# Altium schematic sheet Balancing_Robot_1_2_Sensors.SchDoc: Hebrides Robot - Sensors
size A3; DrawnBy: Stuart Taylor; Revision: 1.2; SheetNumber: 2; SheetTotal: 3
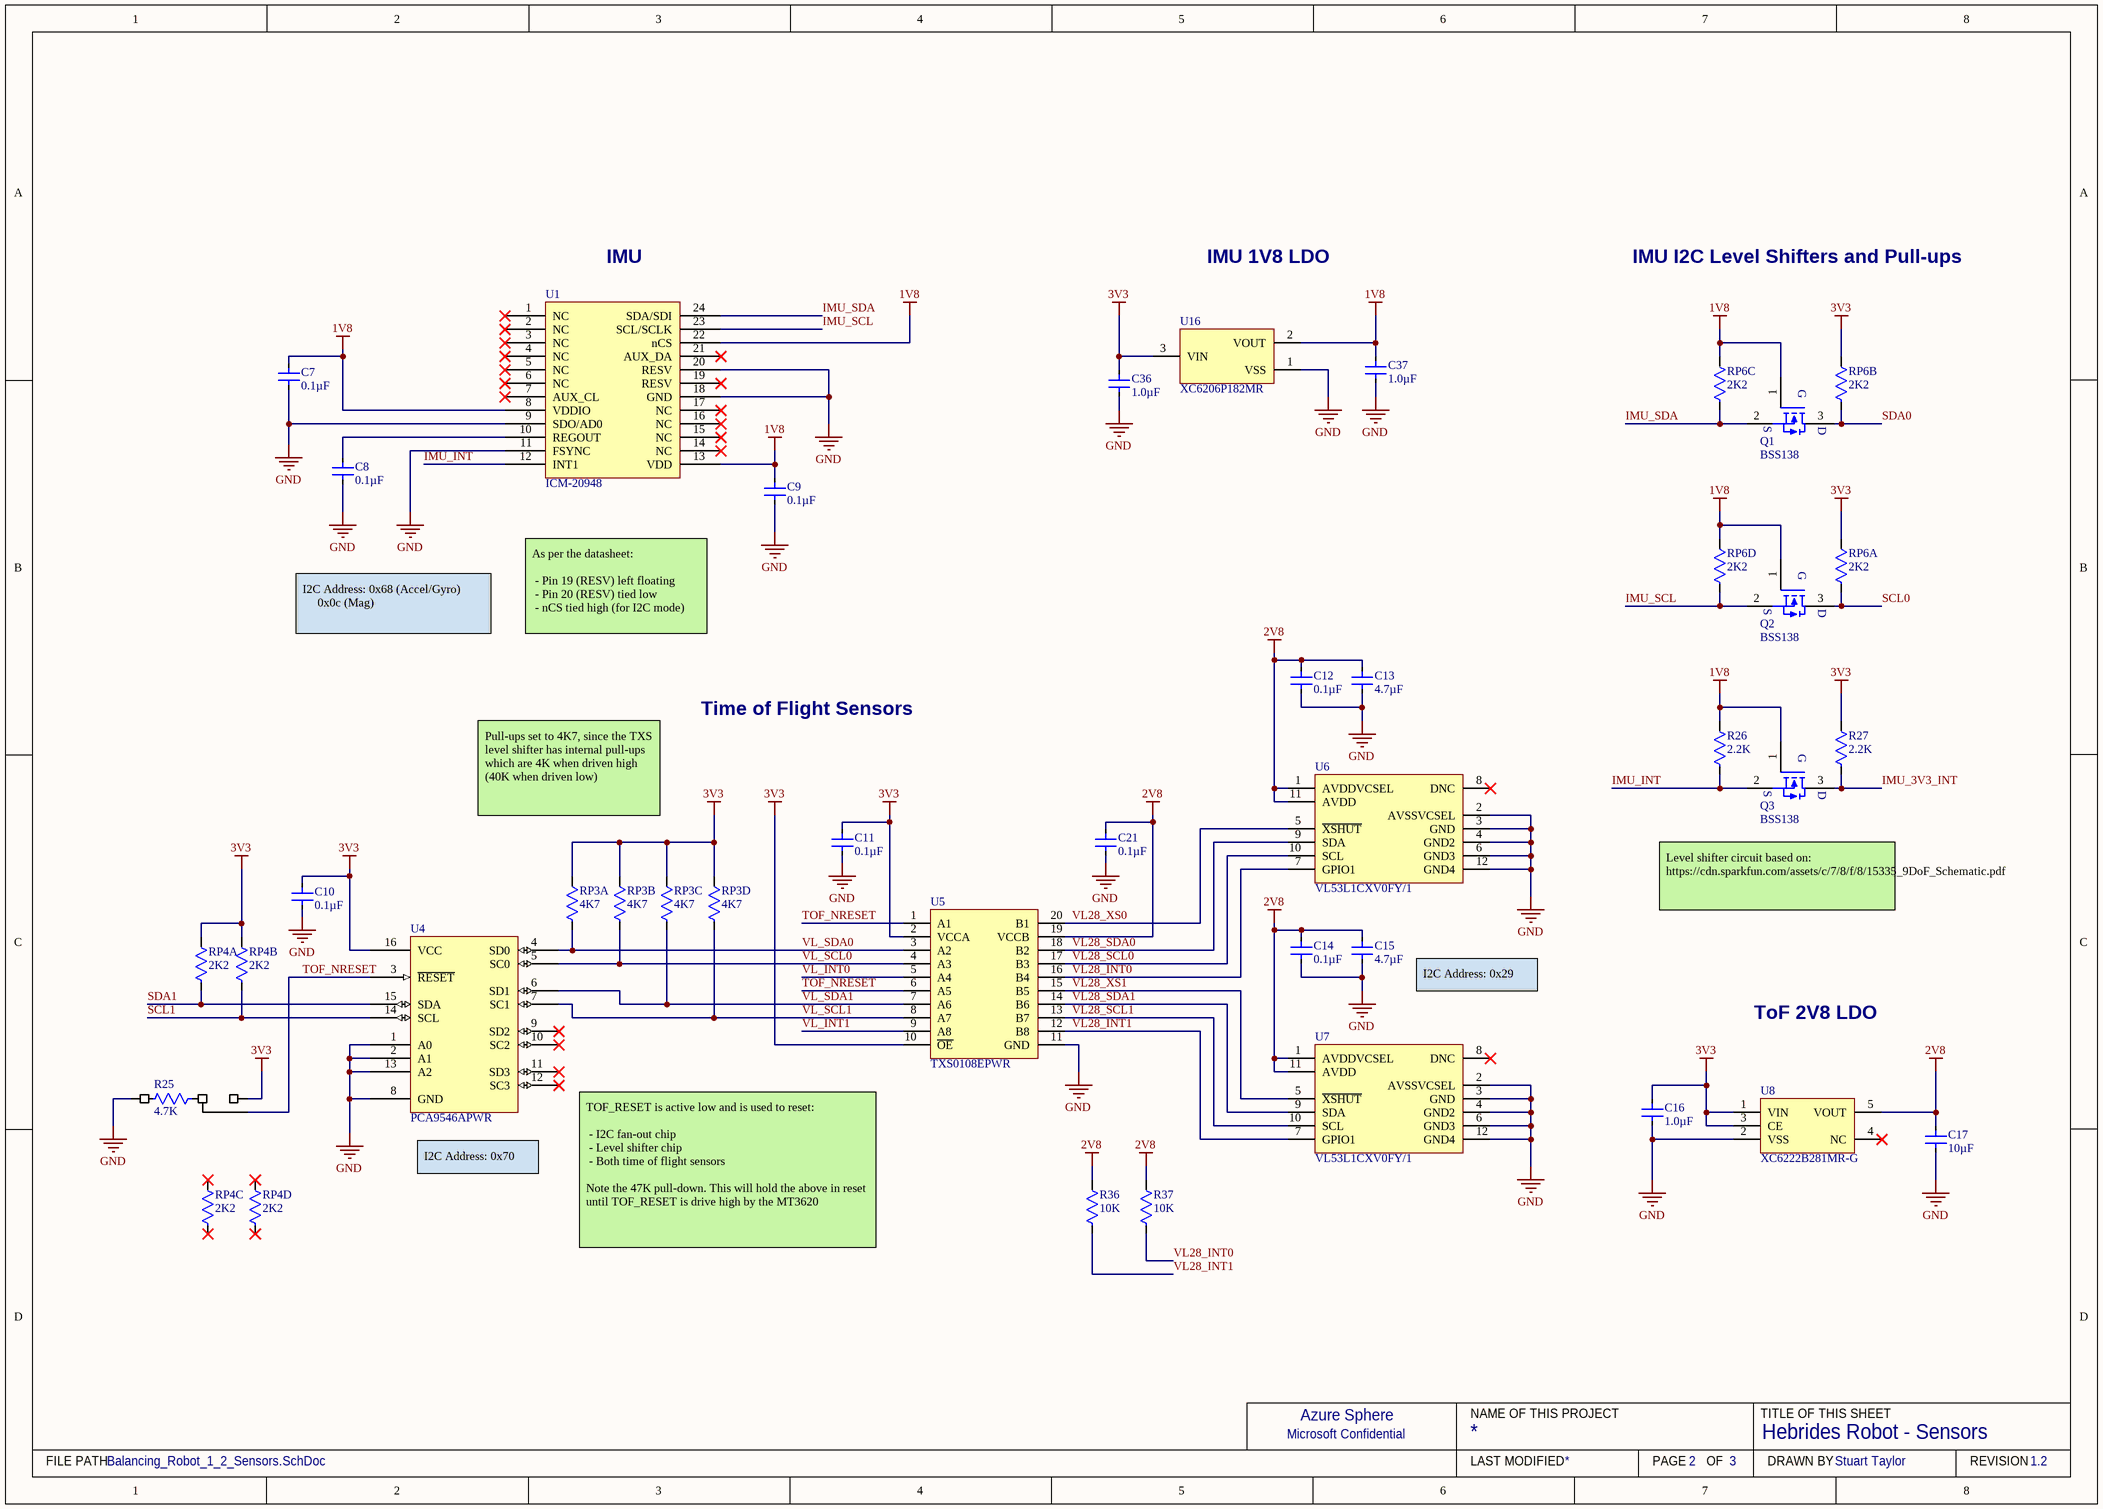
[diagram p0: Balancing_Robot_1_2_Sensors.SchDoc]

## Parts
C7  0.1µF  [CAPC1005-EIA0402 0.55MM MED]
C8  0.1µF  [CAPC1005-EIA0402 0.55MM MED]
C9  0.1µF  [CAPC1005-EIA0402 0.55MM MED]
C10  0.1µF  [CAPC1005-EIA0402 0.55MM MED]
C11  0.1µF  [CAPC1005-EIA0402 0.55MM MED]
C12  0.1µF  [CAPC1005-EIA0402 0.55MM MED]
C13  Capacitance: 4.7µF  [CAPC1005-EIA0402 0.55MM MED]  (hidden comment: C1005X5R1A475K050BC)
C14  0.1µF  [CAPC1005-EIA0402 0.55MM MED]
C15  Capacitance: 4.7µF  [CAPC1005-EIA0402 0.55MM MED]  (hidden comment: C1005X5R1A475K050BC)
C16  Capacitance: 1.0µF  [CAPC1005-EIA0402 0.55MM MED]  (hidden comment: C1005X5R1V105K050BC)
C17  10µF  [CAPC1005-EIA0402 0.55MM MED]
C21  0.1µF  [CAPC1005-EIA0402 0.55MM MED]
C36  Capacitance: 1.0µF  [CAPC1005-EIA0402 0.55MM MED]  (hidden comment: C1005X5R1V105K050BC)
C37  Capacitance: 1.0µF  [CAPC1005-EIA0402 0.55MM MED]  (hidden comment: C1005X5R1V105K050BC)
Q1  BSS138  [TOREX-SOT23-3]
Q2  BSS138  [TOREX-SOT23-3]
Q3  BSS138  [TOREX-SOT23-3]
R25  4.7K  [THREE-WAY-0402-NO-SHORT]
R26  2.2K  [RES 0402 MEDIUM DENSITY]
R27  2.2K  [RES 0402 MEDIUM DENSITY]
R36  10K  [RES 0402 MEDIUM DENSITY]
R37  10K  [RES 0402 MEDIUM DENSITY]
RP3  4K7  [EXB-N8V]  (parts A,B,C,D of 4)
RP4  2K2  [EXB-N8V]  (parts A,B,C,D of 4)
RP6  2K2  [EXB-N8V]  (parts A,B,C,D of 4)
U1  ICM-20948  [ICM_20948]
U4  PCA9546APWR  [PCA9546APWR]
U5  TXS0108EPWR  [TXS0108EPWR]
U6  VL53L1CXV0FY/1  [VL53L1X]
U7  VL53L1CXV0FY/1  [VL53L1X]
U8  XC6222B281MR-G  [SOT25]
U16  XC6206P182MR  [TOREX-SOT23-3]

## Nets
1V8: C7.2 C9.2 C37.2 Q1.1(G) Q2.1(G) Q3.1(G) R26.1 RP6.6 RP6.8 U1.8(VDDIO) U1.13(VDD) U1.22(nCS) U16.2(VOUT)
2V8: C12.2 C13.2 C14.2 C15.2 C17.2 C21.2 R36.1 R37.1 U5.19(VCCB) U6.1(AVDDVCSEL) U6.11(AVDD) U7.1(AVDDVCSEL) U7.11(AVDD) U8.5(VOUT)
3V3: C10.2 C11.2 C16.2 C36.2 R25.3 R27.1 RP3.2 RP3.4 RP3.6 RP3.8 RP4.2 RP4.4 RP6.2 RP6.4 U4.16(VCC) U5.2(VCCA) U5.10(~{OE}) U8.1(VIN) U8.3(CE) U16.3(VIN)
GND: C7.1 C8.1 C9.1 C10.1 C11.1 C12.1 C13.1 C14.1 C15.1 C16.1 C17.1 C21.1 C36.1 C37.1 R25.1 U1.9(SDO/AD0) U1.11(FSYNC) U1.18(GND) U1.20(RESV) U4.1(A0) U4.2(A1) U4.8(GND) U4.13(A2) U5.11(GND) U6.2(AVSSVCSEL) U6.3(GND) U6.4(GND2) U6.6(GND3) U6.12(GND4) U7.2(AVSSVCSEL) U7.3(GND) U7.4(GND2) U7.6(GND3) U7.12(GND4) U8.2(VSS) U16.1(VSS)
IMU_3V3_INT: Q3.3(D) R27.2
IMU_INT: Q3.2(S) R26.2 U1.12(INT1)
IMU_SCL: Q2.2(S) RP6.7 U1.23(SCL/SCLK)
IMU_SDA: Q1.2(S) RP6.5 U1.24(SDA/SDI)
SCL0: Q2.3(D) RP6.1
SCL1: RP4.3 U4.14(SCL)
SDA0: Q1.3(D) RP6.3
SDA1: RP4.1 U4.15(SDA)
TOF_NRESET: R25.2 U4.3(~{RESET}) U5.1(A1) U5.6(A5)
VL28_INT0: R37.2 U5.16(B4) U6.7(GPIO1)
VL28_INT1: R36.2 U5.12(B8) U7.7(GPIO1)
VL28_SCL0: U5.17(B3) U6.10(SCL)
VL28_SCL1: U5.13(B7) U7.10(SCL)
VL28_SDA0: U5.18(B2) U6.9(SDA)
VL28_SDA1: U5.14(B6) U7.9(SDA)
VL28_XS0: U5.20(B1) U6.5(~{XSHUT})
VL28_XS1: U5.15(B5) U7.5(~{XSHUT})
VL_INT0: U5.5(A4)
VL_INT1: U5.9(A8)
VL_SCL0: RP3.3 U4.5(SC0) U5.4(A3)
VL_SCL1: RP3.7 U4.7(SC1) U5.8(A7)
VL_SDA0: RP3.1 U4.4(SD0) U5.3(A2)
VL_SDA1: RP3.5 U4.6(SD1) U5.7(A6)
NetC8_2: C8.2 U1.10(REGOUT)

Not connected (* = marked no-connect by the designer): RP4 5* 6* 7* 8*; U1 1(NC)* 2(NC)* 3(NC)* 4(NC)* 5(NC)* 6(NC)* 7(AUX_CL)* 14(NC)* 15(NC)* 16(NC)* 17(NC)* 19(RESV)* 21(AUX_DA)*; U4 9(SD2)* 10(SC2)* 11(SD3)* 12(SC3)*; U6 8(DNC)*; U7 8(DNC)*; U8 4(NC)*

## Notes on the sheet
- (near U1) IMU
- IMU 1V8 LDO
- IMU I2C Level Shifters and Pull-ups
- I2C Address: 0x68 (Accel/Gyro)
  0x0c (Mag)
- As per the datasheet:
  - Pin 19 (RESV) left floating
  - Pin 20 (RESV) tied low
  - nCS tied high (for I2C mode)
- Time of Flight Sensors
- Pull-ups set to 4K7, since the TXS level shifter has internal pull-ups which are 4K when driven high (40K when driven low)
- Level shifter circuit based on: https://cdn.sparkfun.com/assets/c/7/8/f/8/15335_9DoF_Schematic.pdf
- I2C Address: 0x29
- ToF 2V8 LDO
- (near U4) I2C Address: 0x70
- TOF_RESET is active low and is used to reset:
  - I2C fan-out chip
  - Level shifter chip
  - Both time of flight sensors
  Note the 47K pull-down. This will hold the above in reset until TOF_RESET is drive high by the MT3620
- Microsoft Confidential
- Azure Sphere
- NAME OF THIS PROJECT
- TITLE OF THIS SHEET
- FILE PATH
- LAST MODIFIED
- PAGE
- OF
- DRAWN BY
- REVISION

## Library data of the parts
C7-C12 C14 C21 = 0.1µF 0402 X7R 50V: CAP CER 0.1UF 50V 10% X7R 0402; Manufacturer: TDK Corporation; Manufacturer Part Number: C1005X7R1H104K050BB; Supplier 1: Digi-Key; RoHS: RoHS Compliant; Category: Capacitors; Stock 1: 47833; Pricing 1: 0.01305; Packaging: Tape & Reel (TR); Tolerance: ±10%; Voltage - Rated: 50V; Temperature Coefficient: X7R; Mounting Type: Surface Mount, MLCC; Operating Temperature: -55°C ~ 125°C; Applications: General Purpose; Package / Case: 0402 (1005 Metric); Size / Dimension: 0.039" L x 0.020" W (1.00mm x 0.50mm); Height - Seated (Max): -; Thickness (Max): 0.022" (0.55mm); Lead Spacing: -; Features: -; Lead Style: -; ComponentLink1URL: http://product.tdk.com/en/catalog/datasheets/mlcc_commercial_general_en.pdf; ComponentLink1Description: http://product.tdk.com/en/catalog/datasheets/mlcc_commercial_general_en.pdf; Supplier Part Number 1: 445-5932-2-ND; Ratings: -; Capacitance: 0.1µF
C13 C15 = 4.7µF 0402 X5R 10V: CAP CER 4.7UF 10V 10% X5R 0402; Manufacturer: TDK Corporation; Supplier 1: Digi-Key; Manufacturer Part Number: C1005X5R1A475K050BC; RoHS: RoHS Compliant; Category: Capacitors; Stock 1: 47833; Pricing 1: 0.06265; Packaging: Tape & Reel (TR); Tolerance: ±10%; Voltage - Rated: 10V; Temperature Coefficient: X5R; Mounting Type: Surface Mount, MLCC; Operating Temperature: -55°C ~ 125°C; Applications: General Purpose; Package / Case: 0402 (1005 Metric); Size / Dimension: 0.039" L x 0.020" W (1.00mm x 0.50mm); Height - Seated (Max): -; Thickness (Max): 0.022" (0.55mm); Lead Spacing: -; Features: -; Lead Style: -; ComponentLink1URL: http://product.tdk.com/en/catalog/datasheets/mlcc_commercial_general_en.pdf; ComponentLink1Description: http://product.tdk.com/en/catalog/datasheets/mlcc_commercial_general_en.pdf; Supplier Part Number 1: 445-13820-2-ND; Ratings: -
C16 C36 C37 = 1.0µF 0402 X5R 35V: CAP CER 1UF 35V 10% X5R 0402; Manufacturer: TDK Corporation; Supplier 1: Digi-Key; Manufacturer Part Number: C1005X5R1V105K050BC; RoHS: RoHS Compliant; Category: Capacitors; Stock 1: 47833; Pricing 1: 0.0186; Packaging: Tape & Reel (TR); Tolerance: ±10%; Voltage - Rated: 35V; Temperature Coefficient: X5R; Mounting Type: Surface Mount, MLCC; Operating Temperature: -55°C ~ 125°C; Applications: General Purpose; Package / Case: 0402 (1005 Metric); Size / Dimension: 0.039" L x 0.020" W (1.00mm x 0.50mm); Height - Seated (Max): -; Thickness (Max): 0.022" (0.55mm); Lead Spacing: -; Features: -; Lead Style: -; ComponentLink1URL: http://product.tdk.com/en/catalog/datasheets/mlcc_commercial_general_en.pdf; ComponentLink1Description: http://product.tdk.com/en/catalog/datasheets/mlcc_commercial_general_en.pdf; Supplier Part Number 1: 445-9073-2-ND; Ratings: -
C17 = 10µF 0402 X5R 6.3V: CAP CER 10UF 6.3V 20% X5R 0402; Manufacturer: TDK Corporation; Manufacturer Part Number: C1005X5R0J106M050BC; Supplier 1: Digi-Key; RoHS: RoHS Compliant; Category: Capacitors; Stock 1: 47833; Pricing 1: 0.07766; Packaging: Tape & Reel (TR); Tolerance: ±20%; Voltage - Rated: 6.3V; Temperature Coefficient: X5R; Mounting Type: Surface Mount, MLCC; Operating Temperature: -55°C ~ 125°C; Applications: General Purpose; Package / Case: 0402 (1005 Metric); Size / Dimension: 0.039" L x 0.020" W (1.00mm x 0.50mm); Height - Seated (Max): -; Thickness (Max): 0.020" (0.50mm); Lead Spacing: -; Features: -; Lead Style: -; ComponentLink1URL: http://product.tdk.com/en/catalog/datasheets/mlcc_commercial_general_en.pdf; ComponentLink1Description: http://product.tdk.com/en/catalog/datasheets/mlcc_commercial_general_en.pdf; Supplier Part Number 1: 445-8920-2-ND; Ratings: -; Capacitance: 10µF
Q1-Q3 = BSS138: MOSFET N-CH 50V 220MA SOT-23; Manufacturer: Micross; Supplier 1: Digi-Key; Manufacturer Part Number: BSS138; Stock 1: 0; Pricing 1: 25 = 4.00000 (USD); Supplier Part Number 1: BSS138-DIE-ND
R25 = THREE-WAY-4K7-0402-NO-SHORT: RES SMD 4.7K JUMPER 1/10W 0402; Manufacturer: Panasonic Electronic Components; Manufacturer Part Number: ERJ-2RKF4701X; Power (Watts): 0.1W, 1/10W; Supplier 1: Digi-Key; RoHS: RoHS Compliant; Category: Resistors; Stock 1: 3259868; Pricing 1: 1=0.08, 50=0.0104, 100=0.0079, 250=0.00588, 500=0.00436, 1000=0.0029, 5000=0.00204 (GBP); Packaging: Cut Tape (CT); Part Status: Active; Resistance (Ohms): 4.7K; Tolerance: Jumper; Composition: Thick Film; Features: -; Temperature Coefficient: -; Operating Temperature: -55°C ~ 155°C; Package / Case: 0402 (1005 Metric); Supplier Device Package: 0402; Size / Dimension: 0.039" L x 0.020" W (1.00mm x 0.50mm); Height: 0.016" (0.40mm); Number of Terminations: 2; ComponentLink1URL: http://industrial.panasonic.com/www-cgi/jvcr13pz.cgi?E+PZ+3+AOA0001+ERJ2GE0R00X+7+WW; ComponentLink1Description: http://industrial.panasonic.com/www-cgi/jvcr13pz.cgi?E+PZ+3+AOA0001+ERJ2GE0R00X+7+WW; Supplier Part Number: P4.7KLCT-ND
R26 R27 = 2.2K: RES 2.2K OHM 1/10W 1% 0402 SMD; Manufacturer: Panasonic Electronic Components; Manufacturer Part Number: ERJ-2RKF2201X; Power (Watts): 0.1W, 1/10W; Temperature Coefficient: ±100ppm/°C; Supplier 1: Digi-Key; Supplier Part Number 1: P2.20KLCT-ND; RoHS: RoHS Compliant; Category: Resistors; Stock 1: 529147; Pricing 1: 1=0.07, 50=0.0128, 100=0.0097, 250=0.0072, 500=0.00532, 1000=0.00355, 5000=0.0025 (GBP); Packaging: Cut Tape (CT); Tolerance: ±1%; Composition: Thick Film; Features: -; Package / Case: 0402 (1005 Metric); Supplier Device Package: 0402; Size / Dimension: 0.039" L x 0.020" W (1.00mm x 0.50mm); Height: 0.016" (0.40mm); Number of Terminations: 2; ComponentLink1URL: http://industrial.panasonic.com/www-cgi/jvcr13pz.cgi?E+PZ+3+AOA0002+ERJ2RKF2201X+7+WW; ComponentLink1Description: http://industrial.panasonic.com/www-cgi/jvcr13pz.cgi?E+PZ+3+AOA0002+ERJ2RKF2201X+7+WW; Resistance (Ohms): 2.2K
R36 R37 = 10K: RES 10K OHM 1/10W 1% 0402 SMD; Manufacturer: Panasonic Electronic Components; Manufacturer Part Number: ERJ-2RKF1002X; Power (Watts): 0.1W, 1/10W; Temperature Coefficient: ±100ppm/°C; Supplier 1: Digi-Key; Supplier Part Number 1: P10.0KLCT-ND; RoHS: RoHS Compliant; Category: Resistors; Stock 1: 4805447; Pricing 1: 1=0.07, 50=0.0128, 100=0.0097, 250=0.0072, 500=0.00532, 1000=0.00355, 5000=0.0025 (GBP); Packaging: Cut Tape (CT); Tolerance: ±1%; Composition: Thick Film; Features: -; Package / Case: 0402 (1005 Metric); Supplier Device Package: 0402; Size / Dimension: 0.039" L x 0.020" W (1.00mm x 0.50mm); Height: 0.016" (0.40mm); Number of Terminations: 2; ComponentLink1URL: http://industrial.panasonic.com/www-cgi/jvcr13pz.cgi?E+PZ+3+AOA0002+ERJ2RKF1002X+7+WW; ComponentLink1Description: http://industrial.panasonic.com/www-cgi/jvcr13pz.cgi?E+PZ+3+AOA0002+ERJ2RKF1002X+7+WW; Resistance (Ohms): 10K
RP3 = EXB-N8V472JX: Res Thick Film Array 4.7K Ohm 5% ±200ppm/C ISOL Molded 8-Pin 0804(4 X 0402) Concave SMD Punched Carrier T/R; Manufacturer: Panasonic / Panasonic ECG; Power Rating per Element: 31mW; Voltage Rating: 50V; Temperature Coefficient: ± 200ppm/°C; No. of Elements: 4; Resistor Case Style: 0402 [1005 Metric]; SVHC: Diboron trioxide (19-Dec-2012); Resistor Terminals: (Not Available); SVHC (Secondary): Lead monoxide (lead oxide) (19-Dec-2012); No. of Pins: 8; Network Circuit Type: Isolated; Supplier 1: Digikey; Manufacturer Part Number: EXB-N8V472JX; Stock 1: 38086; Pricing 1: 1=0.1, 10=0.075, 25=0.0544, 50=0.0414, 100=0.0305, 250=0.0233, 500=0.0186, 1000=0.0137, 5000=0.0098 (USD); Resistance: 4.7kohm; Resistance Tolerance: ± 5%; Resistor Mounting: SMD; Packaging: Cut Tape; ComponentLink1URL: https://datasheet.ciiva.com/5735/1480003-5735259.pdf; ComponentLink1Description: https://datasheet.ciiva.com/5735/1480003-5735259.pdf; ComponentLink2URL: https://datasheet.ciiva.com/46376/1480003-46376271.pdf; ComponentLink2Description: https://datasheet.ciiva.com/46376/1480003-46376271.pdf; ComponentLink3URL: https://datasheet.ciiva.com/30229/aoc0000ce1-30229813.pdf; ComponentLink3Description: https://datasheet.ciiva.com/30229/aoc0000ce1-30229813.pdf; ComponentLink4URL: https://datasheet.ciiva.com/46387/1480003-46387943.pdf; ComponentLink4Description: https://datasheet.ciiva.com/46387/1480003-46387943.pdf; Supplier Part Number 1: Y10472CT-ND
RP4 RP6 = EXB-N8V222JX: Res Thick Film Array 2K2 Ohm 5% ±200ppm/C ISOL Molded 8-Pin 0804(4 X 0402) Concave SMD Punched Carrier T/R; Manufacturer: Panasonic / Panasonic ECG; Resistance: 2.2kohm; Power Rating per Element: 31mW; Voltage Rating: 50V; Temperature Coefficient: ± 200ppm/°C; No. of Elements: 4; Resistor Case Style: 0402 [1005 Metric]; SVHC: Diboron trioxide (19-Dec-2012); Resistor Terminals: (Not Available); SVHC (Secondary): Lead monoxide (lead oxide) (19-Dec-2012); No. of Pins: 8; Network Circuit Type: Isolated; Supplier 1: Digikey; Manufacturer Part Number: EXB-N8V222JX; Stock 1: 17267; Pricing 1: 1=0.1, 10=0.075, 25=0.0544, 50=0.0414, 100=0.0305, 250=0.0233, 500=0.0186, 1000=0.0137, 5000=0.0098 (USD); Resistance Tolerance: ± 5%; Resistor Mounting: SMD; Packaging: Cut Tape; ComponentLink1URL: https://datasheet.ciiva.com/28637/1790599-28637084.pdf; ComponentLink1Description: https://datasheet.ciiva.com/28637/1790599-28637084.pdf; ComponentLink2URL: https://datasheet.ciiva.com/46388/1480003-46388015.pdf; ComponentLink2Description: https://datasheet.ciiva.com/46388/1480003-46388015.pdf; ComponentLink3URL: https://datasheet.ciiva.com/5735/1480003-5735240.pdf; ComponentLink3Description: https://datasheet.ciiva.com/5735/1480003-5735240.pdf; ComponentLink4URL: https://datasheet.ciiva.com/30142/aoc0000ce1-30142629.pdf; ComponentLink4Description: https://datasheet.ciiva.com/30142/aoc0000ce1-30142629.pdf; ComponentLink5URL: https://datasheet.ciiva.com/46376/1480003-46376278.pdf; ComponentLink5Description: https://datasheet.ciiva.com/46376/1480003-46376278.pdf; Supplier Part Number 1: Y10222CT-ND; Case Code (Imperial): 0402; Case Code (Metric): 1005
U1 = ICM-20948: 9-axis IMU; Manufacturer: TDK; Supplier 1: Farnell; Manufacturer Part Number: ICM-20948; Stock 1: 0; Pricing 1: 150=3.40000, 250=3.21000, 500=3.10000 (GBP); RoHS: No; ComponentLink1URL: http://www.farnell.com/datasheets/2632662.pdf?src-supplier=Farnell; ComponentLink1Description: http://www.farnell.com/datasheets/2632662.pdf?src-supplier=Farnell; Supplier Part Number 1: 2911498RL
U4 = PCA9546APWR: TEXAS INSTRUMENTS         PCA9546APWR             ANALOG MULTIPLEXER, QUAD 4 X 1, TSSOP-16, FULL REEL; Number of Outputs: 1; Max Frequency: 400kHz; Min Supply Voltage: 2.3V; Max Supply Voltage: 5.5V; Number of Inputs: 4; Propagation Delay: 1ns; Power Dissipation: 400mW; On-State Resistance: 16R; Operating Supply Current: 8uA; Throw Configuration: 4PST; Quiescent Current: 3uA; Supplier 1: Digi-Key; Manufacturer: Texas Instruments; Manufacturer Part Number: PCA9546APWR; Stock 1: 4404; Pricing 1: 1=1.89000, 10=1.70100, 25=1.60520, 100=1.28400, 250=1.12352, 500=1.09140, 1000=0.86670 (USD); RoHS: Yes; Case/Package: TSSOP; Number of Pins: 16; Weight: 0.002183oz; Contact Plating: Gold; Min Operating Temperature: -40°C; Max Operating Temperature: 85°C; Packaging: Tape and Reel; Package Quantity: 2000; Logic Function: Multiplexer; Bandwidth: 400kHz; Max Power Dissipation: 400mW; Number of Channels: 4; Number of Circuits: 4; Radiation Hardening: No; Lead Free: Lead Free; REACH SVHC: No SVHC; ComponentLink1URL: https://datasheet.ciiva.com/15087/getdatasheetpartid-347185-15087370.pdf?src-supplier=Verical; ComponentLink1Description: https://datasheet.ciiva.com/15087/getdatasheetpartid-347185-15087370.pdf?src-supplier=Verical; ComponentLink2URL: https://datasheet.ciiva.com/26839/pca9546apwr-26839938.pdf?src-supplier=IIIC; ComponentLink2Description: https://datasheet.ciiva.com/26839/pca9546apwr-26839938.pdf?src-supplier=IIIC; ComponentLink3URL: https://datasheet.ciiva.com/1784/pca9546a-1784239.pdf?src-supplier=Digi-Key; ComponentLink3Description: https://datasheet.ciiva.com/1784/pca9546a-1784239.pdf?src-supplier=Digi-Key; ComponentLink4URL: https://datasheet.ciiva.com/1784/pca9546a-1784237.pdf?src-supplier=Digi-Key; ComponentLink4Description: https://datasheet.ciiva.com/1784/pca9546a-1784237.pdf?src-supplier=Digi-Key; ComponentLink5URL: https://datasheet.ciiva.com/1784/pca9546a-1784238.pdf?src-supplier=Digi-Key; ComponentLink5Description: https://datasheet.ciiva.com/1784/pca9546a-1784238.pdf?src-supplier=Digi-Key; Supplier Part Number 1: 296-20968-1-ND
U5 = TXS0108EPWR: IC 8BIT NON-INV TRANSLTR 20TSSOP; Manufacturer: Texas Instruments; Data Rate: 60Mbps; Number of Bits: 8; High Level Output Current: -50mA; Propagation Delay: 4.8ns; Min Supply Voltage: 1.2V; Max Supply Voltage: 5.5V; Logic Function: Translator; Low Level Output Current: 50mA; Turn-On Delay Time: 312ns; Quiescent Current: 3uA; Output Type: Voltage; Output Current: 620uA; Rise Time: 6.3ns; Nominal Supply Current: 8uA; Supplier 1: Digi-Key; Manufacturer Part Number: TXS0108EPWR; Stock 1: 13915; Pricing 1: 1=1.61000, 10=1.44700, 25=1.36520, 100=1.16300, 250=1.09200, 500=0.95550, 1000=0.79170 (USD); RoHS: Yes; Mount: Surface Mount; Case/Package: TSSOP; Number of Pins: 20; Weight: 0.002716oz; Contact Plating: Gold; Min Operating Temperature: -40°C; Max Operating Temperature: 85°C; Packaging: Tape and Reel; Number of Channels: 8; Package Quantity: 1; Number of Inputs: 8; Termination: SMD/SMT; Length: 6.5mm; Height: 1.15mm; Width: 4.4mm; Radiation Hardening: No; Lead Free: Lead Free; REACH SVHC: No SVHC; ComponentLink1URL: https://datasheet.ciiva.com/14287/txs0108e-14287280.pdf?src-supplier=Farnell; ComponentLink1Description: https://datasheet.ciiva.com/14287/txs0108e-14287280.pdf?src-supplier=Farnell; ComponentLink2URL: https://datasheet.ciiva.com/15096/getdatasheetpartid-322119-15096276.pdf?src-supplier=Verical; ComponentLink2Description: https://datasheet.ciiva.com/15096/getdatasheetpartid-322119-15096276.pdf?src-supplier=Verical; ComponentLink3URL: https://datasheet.ciiva.com/28653/1714661-28653429.pdf?src-supplier=Element14; ComponentLink3Description: https://datasheet.ciiva.com/28653/1714661-28653429.pdf?src-supplier=Element14; ComponentLink4URL: https://datasheet.ciiva.com/4834/sces642b-127094-4834401.pdf?src-supplier=Mouser; ComponentLink4Description: https://datasheet.ciiva.com/4834/sces642b-127094-4834401.pdf?src-supplier=Mouser; ComponentLink5URL: https://datasheet.ciiva.com/1508/1815244-1508732.pdf?src-supplier=Element14; ComponentLink5Description: https://datasheet.ciiva.com/1508/1815244-1508732.pdf?src-supplier=Element14; ComponentLink6URL: https://datasheet.ciiva.com/1899/txs0108e-1899604.pdf?src-supplier=Digi-Key; ComponentLink6Description: https://datasheet.ciiva.com/1899/txs0108e-1899604.pdf?src-supplier=Digi-Key; ComponentLink7URL: https://datasheet.ciiva.com/1899/txs0108e-1899605.pdf?src-supplier=Digi-Key; ComponentLink7Description: https://datasheet.ciiva.com/1899/txs0108e-1899605.pdf?src-supplier=Digi-Key; ComponentLink8URL: https://datasheet.ciiva.com/1899/txs0108e-1899606.pdf?src-supplier=Digi-Key; ComponentLink8Description: https://datasheet.ciiva.com/1899/txs0108e-1899606.pdf?src-supplier=Digi-Key; ComponentLink9URL: https://datasheet.ciiva.com/14287/txs0108e-14287532.pdf?src-supplier=Avnet; ComponentLink9Description: https://datasheet.ciiva.com/14287/txs0108e-14287532.pdf?src-supplier=Avnet; ComponentLink10URL: https://datasheet.ciiva.com/26039/txs0108e-26039599.pdf?src-supplier=Avnet+Europe; ComponentLink10Description: https://datasheet.ciiva.com/26039/txs0108e-26039599.pdf?src-supplier=Avnet+Europe; Supplier Part Number 1: 296-23011-1-ND
U6 U7 = VL53L1CXV0FY/1: OPTICAL LGA12 4.9X2; Manufacturer: STMicroelectronics; Output Type: I2C; Supplier 1: Farnell; Manufacturer Part Number: VL53L1CXV0FY/1; Stock 1: 2567; Pricing 1: 1=5.68000, 10=4.66000, 25=4.44000, 50=4.15000, 100=3.85000, 250=3.69000, 500=2.93000 (GBP); RoHS: No; Min Operating Temperature: -20°C; Max Operating Temperature: 85°C; ComponentLink1URL: http://www.farnell.com/datasheets/2600105.pdf?src-supplier=Farnell; ComponentLink1Description: http://www.farnell.com/datasheets/2600105.pdf?src-supplier=Farnell; ComponentLink2URL: http://www.st.com/content/ccc/resource/technical/document/datasheet/group3/7d/85/c8/95/fb/3b/4e/2d/DM00452094/files/DM00452094.pdf/jcr:content/translations/en.DM00452094.pdf?src-supplier=Digi-Key; ComponentLink2Description: http://www.st.com/content/ccc/resource/technical/document/datasheet/group3/7d/85/c8/95/fb/3b/4e/2d/DM00452094/files/DM00452094.pdf/jcr:content/translations/en.DM00452094.pdf?src-supplier=Digi-Key; Supplier Part Number 1: 2851946
U8 = XC6222B281MR-G: Reverse Current Protection, 700mA High Speed LDO Regulator; Manufacturer: Torex; Number of Outputs: 1; Min Input Voltage: 1.7V; Accuracy: 1%; Max Input Voltage: 6V; Output Voltage: 2.8V; Max Power Dissipation: 250mW; Polarity: Positive; Output Type: Fixed; Dropout Voltage: 160mV; Min Current Limit: 720mA; Supplier 1: Digi-Key; Manufacturer Part Number: XC6222B281MR-G; Stock 1: 3964; Pricing 1: 1=0.80000, 10=0.70300, 25=0.66040, 100=0.50060, 250=0.42600, 500=0.40470, 1000=0.30885 (USD); RoHS: Yes; Mount: Surface Mount; Case/Package: SOT-25; Min Operating Temperature: -40°C; Max Operating Temperature: 85°C; Package Quantity: 1; Packaging: Cut Tape; Output Current: 700mA; Number of Regulators: 1; Radiation Hardening: No; ComponentLink1URL: https://datasheet.ciiva.com/2048/xc6222-2048816.pdf?src-supplier=Digi-Key; ComponentLink1Description: https://datasheet.ciiva.com/2048/xc6222-2048816.pdf?src-supplier=Digi-Key; ComponentLink2URL: https://datasheet.ciiva.com/28427/xc6222-28427291.pdf?src-supplier=Avnet+Europe; ComponentLink2Description: https://datasheet.ciiva.com/28427/xc6222-28427291.pdf?src-supplier=Avnet+Europe; ComponentLink3URL: https://datasheet.ciiva.com/2048/xc6222-2048817.pdf?src-supplier=Digi-Key; ComponentLink3Description: https://datasheet.ciiva.com/2048/xc6222-2048817.pdf?src-supplier=Digi-Key; ComponentLink4URL: https://datasheet.ciiva.com/2048/xc6222-2048815.pdf?src-supplier=Digi-Key; ComponentLink4Description: https://datasheet.ciiva.com/2048/xc6222-2048815.pdf?src-supplier=Digi-Key; Supplier Part Number 1: 893-1141-1-ND
U16 = XC6206P182MR: TOREX         XC6206P182MR             Fixed LDO Voltage Regulator, 1.8V to 6V, 150mV Dropout, 1.8Vout, 80mAout, SOT-23-3; Manufacturer: Torex Semiconductor; Output Current: 80mA; LDO Regulator Case Style: SOT-23; No. of Pins: 3Pins; SVHC: No SVHC (17-Dec-2015); Supplier 1: Farnell; Manufacturer Part Number: XC6206P182MR; Stock 1: 6277; Pricing 1: 1=0.531, 10=0.435, 100=0.357, 250=0.296, 500=0.262, 1000=0.237, 2000=0.233, 6000=0.227 (EUR); Input Voltage Min: 1.8V; Input Voltage Max: 6V; Output Voltage Nom.: 1.8V; Dropout Voltage Vdo: 150mV; Operating Temperature Min: -40°C; Operating Temperature Max: 85°C; Packaging: Cut Tape; ComponentLink1URL: https://datasheet.ciiva.com/22710/578820-22710965.pdf; ComponentLink1Description: https://datasheet.ciiva.com/22710/578820-22710965.pdf; Supplier Part Number 1: 8796920